# Altium schematic sheet Sheet1.SchDoc
size A; SheetNumber: 1; SheetTotal: 1
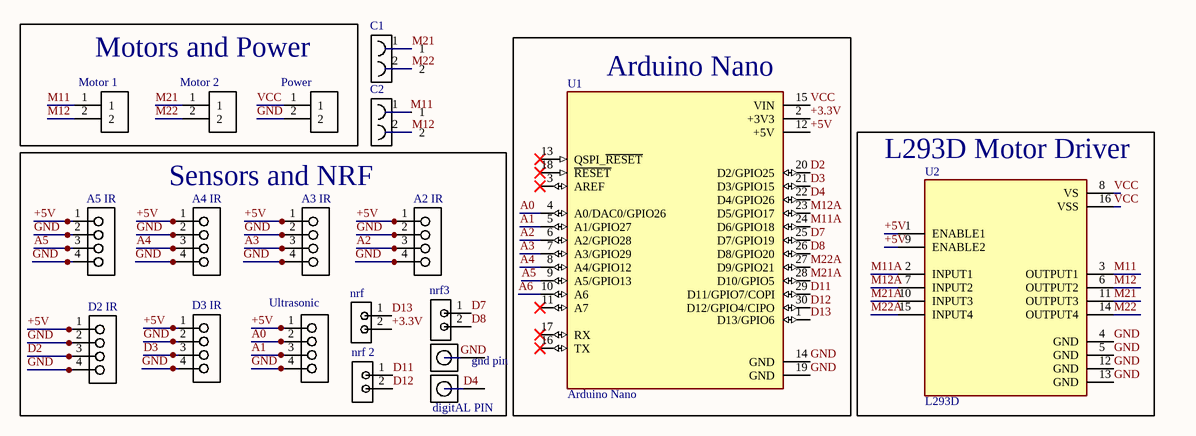
[diagram p0: Sheet1.SchDoc]

## Parts
A2_IR  4pin jst  [4pin jst]  (value not drawn)
A3_IR  4pin jst  [4pin jst]  (value not drawn)
A4_IR  4pin jst  [4pin jst]  (value not drawn)
A5_IR  4pin jst  [4pin jst]  (value not drawn)
C1  Capacitor  [Capacitor]  (value not drawn)
C2  Capacitor  [Capacitor]  (value not drawn)
D2_IR  4pin jst  [4pin jst]  (value not drawn)
D3_IR  4pin jst  [4pin jst]  (value not drawn)
digitAL_PIN  1 pin female header  [1 pin female header]  (value not drawn)
gnd_pin  1 pin female header  [1 pin female header]  (value not drawn)
Motor_1  2pin terminal block  [2pin terminal block]  (value not drawn)
Motor_2  2pin terminal block  [2pin terminal block]  (value not drawn)
nrf  2 pin female header  [2 pin female header]  (value not drawn)
nrf3  2 pin female header  [2 pin female header]  (value not drawn)
nrf_2  2 pin female header  [2 pin female header]  (value not drawn)
Power  2pin terminal block  [2pin terminal block]  (value not drawn)
U1  Arduino Nano  [Arduino Nano]
U2  L293D  [L293D]
Ultrasonic  4pin jst  [4pin jst]  (value not drawn)

## Blocks framed on the sheet
Motors and Power: Motor_1 Motor_2 Power
Arduino Nano: U1
Sensors and NRF: A2_IR A3_IR A4_IR A5_IR D2_IR D3_IR digitAL_PIN gnd_pin nrf nrf3 nrf_2 Ultrasonic
L293D Motor Driver: U2

## Nets
+3.3V: nrf.2 U1.2(+3V3)
+5V: A2_IR.1 A3_IR.1 A4_IR.1 A5_IR.1 D2_IR.1 D3_IR.1 U1.12(+5V) U2.1(ENABLE1) U2.9(ENABLE2) Ultrasonic.1
A0: U1.4(A0/DAC0/GPIO26) Ultrasonic.2
A1: U1.5(A1/GPIO27) Ultrasonic.3
A2: A2_IR.3 U1.6(A2/GPIO28)
A3: A3_IR.3 U1.7(A3/GPIO29)
A4: A4_IR.3 U1.8(A4/GPIO12)
A5: A5_IR.3 U1.9(A5/GPIO13)
A6: U1.10(A6)
D2: D2_IR.3 U1.20(D2/GPIO25)
D3: D3_IR.3 U1.21(D3/GPIO15)
D4: digitAL_PIN.1 U1.22(D4/GPIO26)
D7: nrf3.1 U1.25(D7/GPIO19)
D8: nrf3.2 U1.26(D8/GPIO20)
D11: nrf_2.1 U1.29(D11/GPIO7/COPI)
D12: nrf_2.2 U1.30(D12/GPIO4/CIPO)
D13: nrf.1 U1.1(D13/GPIO6)
GND: A2_IR.2 A2_IR.4 A3_IR.2 A3_IR.4 A4_IR.2 A4_IR.4 A5_IR.2 A5_IR.4 D2_IR.2 D2_IR.4 D3_IR.2 D3_IR.4 gnd_pin.1 Power.2 U1.14(GND) U1.19(GND) U2.4(GND) U2.5(GND) U2.12(GND) U2.13(GND) Ultrasonic.4
M11: C2.1 Motor_1.1 U2.3(OUTPUT1)
M11A: U1.24(D6/GPIO18) U2.2(INPUT1)
M12: C2.2 Motor_1.2 U2.6(OUTPUT2)
M12A: U1.23(D5/GPIO17) U2.7(INPUT2)
M21: C1.1 Motor_2.1 U2.11(OUTPUT3)
M21A: U1.28(D10/GPIO5) U2.10(INPUT3)
M22: C1.2 Motor_2.2 U2.14(OUTPUT4)
M22A: U1.27(D9/GPIO21) U2.15(INPUT4)
VCC: Power.1 U1.15(VIN) U2.8(VS) U2.16(VSS)

Not connected (* = marked no-connect by the designer): U1 3(AREF)* 11(A7)* 13(QSPI_~{RESET})* 16(TX)* 17(RX)* 18(~{RESET})*

## Library data of the parts
A2_IR A3_IR A4_IR A5_IR D2_IR D3_IR Ultrasonic = 4pin jst: Connector Header Through Hole 4 position 0.079 (2.00mm); MP: B4B-PH-K; SnapEDA_Link: https://www.snapeda.com/parts/B4B-PH-K/JST/view-part/?ref=snap; Package: None; MF: JST; Check_prices: https://www.snapeda.com/parts/B4B-PH-K/JST/view-part/?ref=eda; Purchase-URL: https://pricing.snapeda.com/search/part/B4B-PH-K/?ref=eda; Price: None; Value: *; Availability: In Stock
Motor_1 Motor_2 Power = 2pin terminal block: Connector Terminal Blocks Receptacle 2 Position 5.08mm Solder Straight Thru-Hole 13.5A/Contact; MP: 282837-2; MF: TE Connectivity; Check_prices: https://www.snapeda.com/parts/282837-2/TE+Connectivity+AMP+Connectors/view-part/?ref=eda; Value: *; Availability: In Stock; Price: None; Package: None; SnapEDA_Link: https://www.snapeda.com/parts/282837-2/TE+Connectivity+AMP+Connectors/view-part/?ref=snap; Purchase-URL: https://pricing.snapeda.com/search/part/282837-2/?ref=eda
U1 = Arduino Nano: NINA-W102, RP2040 Arduino Nano RP2040 Connect with Headers series ARMÂ® CortexÂ®-M0+ MCU 32-Bit Embedded Evaluation Board; MP: ABX00053; Value: *; SnapEDA_Link: https://www.snapeda.com/parts/ABX00053/Arduino/view-part/?ref=snap; MF: Arduino; Purchase-URL: https://pricing.snapeda.com/search/part/ABX00053/?ref=eda; Check_prices: https://www.snapeda.com/parts/ABX00053/Arduino/view-part/?ref=eda; Digi-Key_Part_Number: 1050-ABX00053-ND; Package: None
U2 = L293D: Bipolar Motor Driver - Parallel 16-PowerDIP; MF: STMicroelectronics; Price: None; Availability: In Stock; Package: DIP-16 STMicroelectronics; MP: L293D; Value: *; SnapEDA_Link: https://www.snapeda.com/parts/L293D/STMicroelectronics/view-part/?ref=snap; Purchase-URL: https://pricing.snapeda.com/search/part/L293D/?ref=eda; Check_prices: https://www.snapeda.com/parts/L293D/STMicroelectronics/view-part/?ref=eda